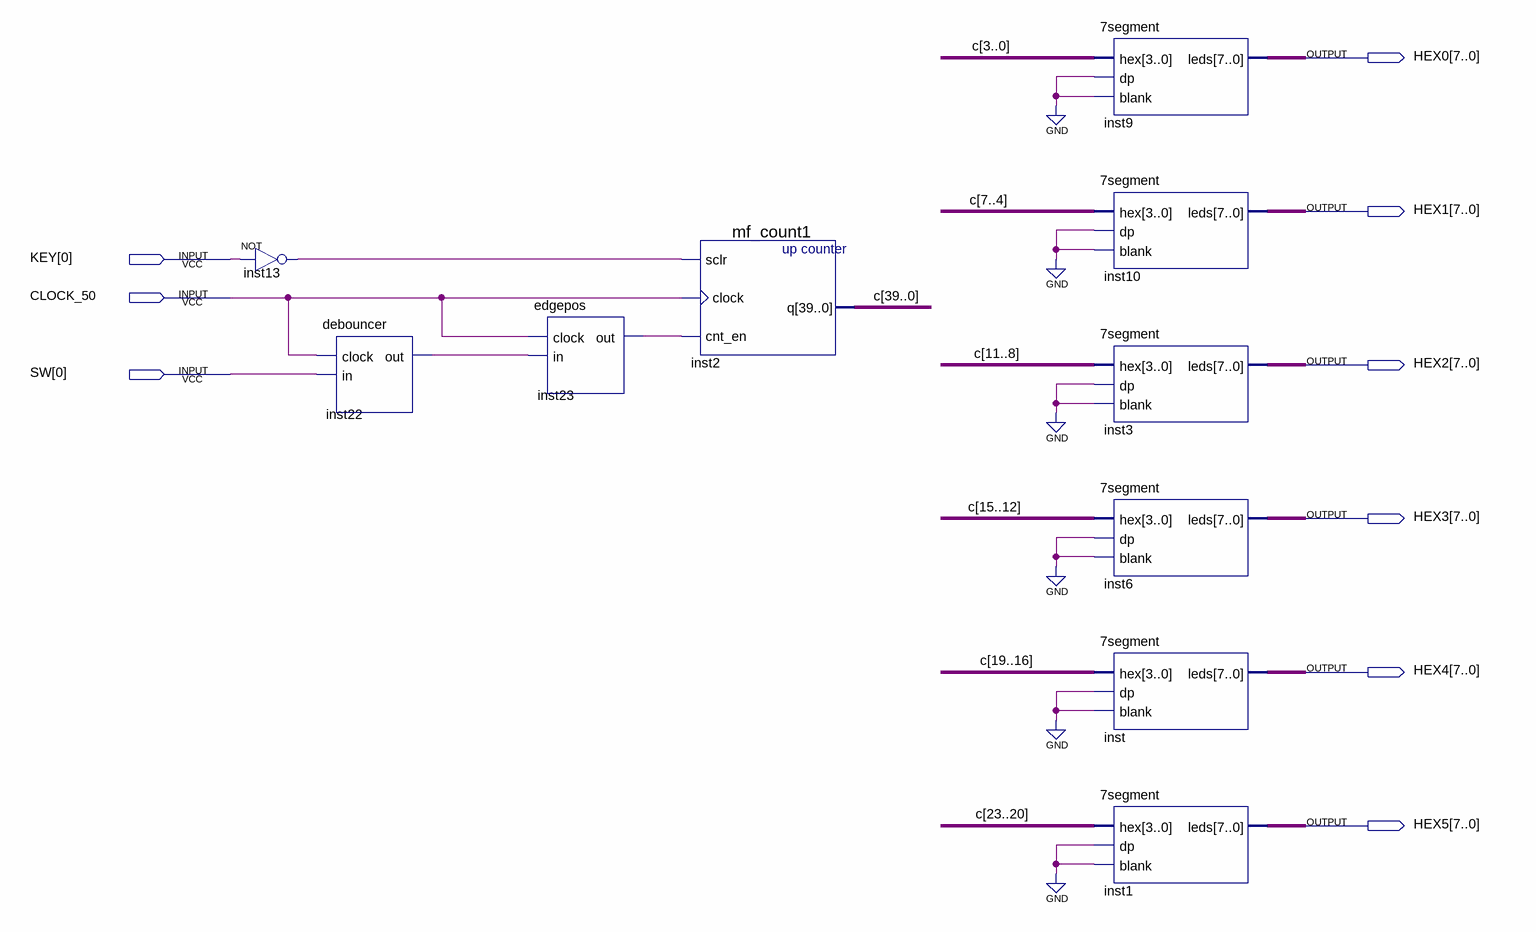
[diagram p0: schematic sheet]
// Quartus schematic Counter.bdf as structural Verilog: 10 symbols, 9 pins
module Counter (
  input  [0:0] KEY,
  input  CLOCK_50,
  input  [0:0] SW,
  output [7:0] HEX0,
  output [7:0] HEX1,
  output [7:0] HEX2,
  output [7:0] HEX3,
  output [7:0] HEX4,
  output [7:0] HEX5
);

  wire inst13_out, inst22_out, inst23_out;
  wire [39:0] c;

  not inst13 (inst13_out, KEY[0]);
  debouncer inst22 (.clock(CLOCK_50), .in(SW[0]), .out(inst22_out));
  edgepos inst23 (.clock(CLOCK_50), .in(inst22_out), .out(inst23_out));
  mf_count1 inst2 (.sclr(inst13_out), .clock(CLOCK_50), .cnt_en(inst23_out), .q(c));
  \7segment  inst9 (.hex(c[3:0]), .dp(1'b0), .blank(1'b0), .leds(HEX0));
  \7segment  inst10 (.hex(c[7:4]), .dp(1'b0), .blank(1'b0), .leds(HEX1));
  \7segment  inst3 (.hex(c[11:8]), .dp(1'b0), .blank(1'b0), .leds(HEX2));
  \7segment  inst6 (.hex(c[15:12]), .dp(1'b0), .blank(1'b0), .leds(HEX3));
  \7segment  inst (.hex(c[19:16]), .dp(1'b0), .blank(1'b0), .leds(HEX4));
  \7segment  inst1 (.hex(c[23:20]), .dp(1'b0), .blank(1'b0), .leds(HEX5));
endmodule
